# EAGLE schematic simpleshield (EAGLE 8.1.1)
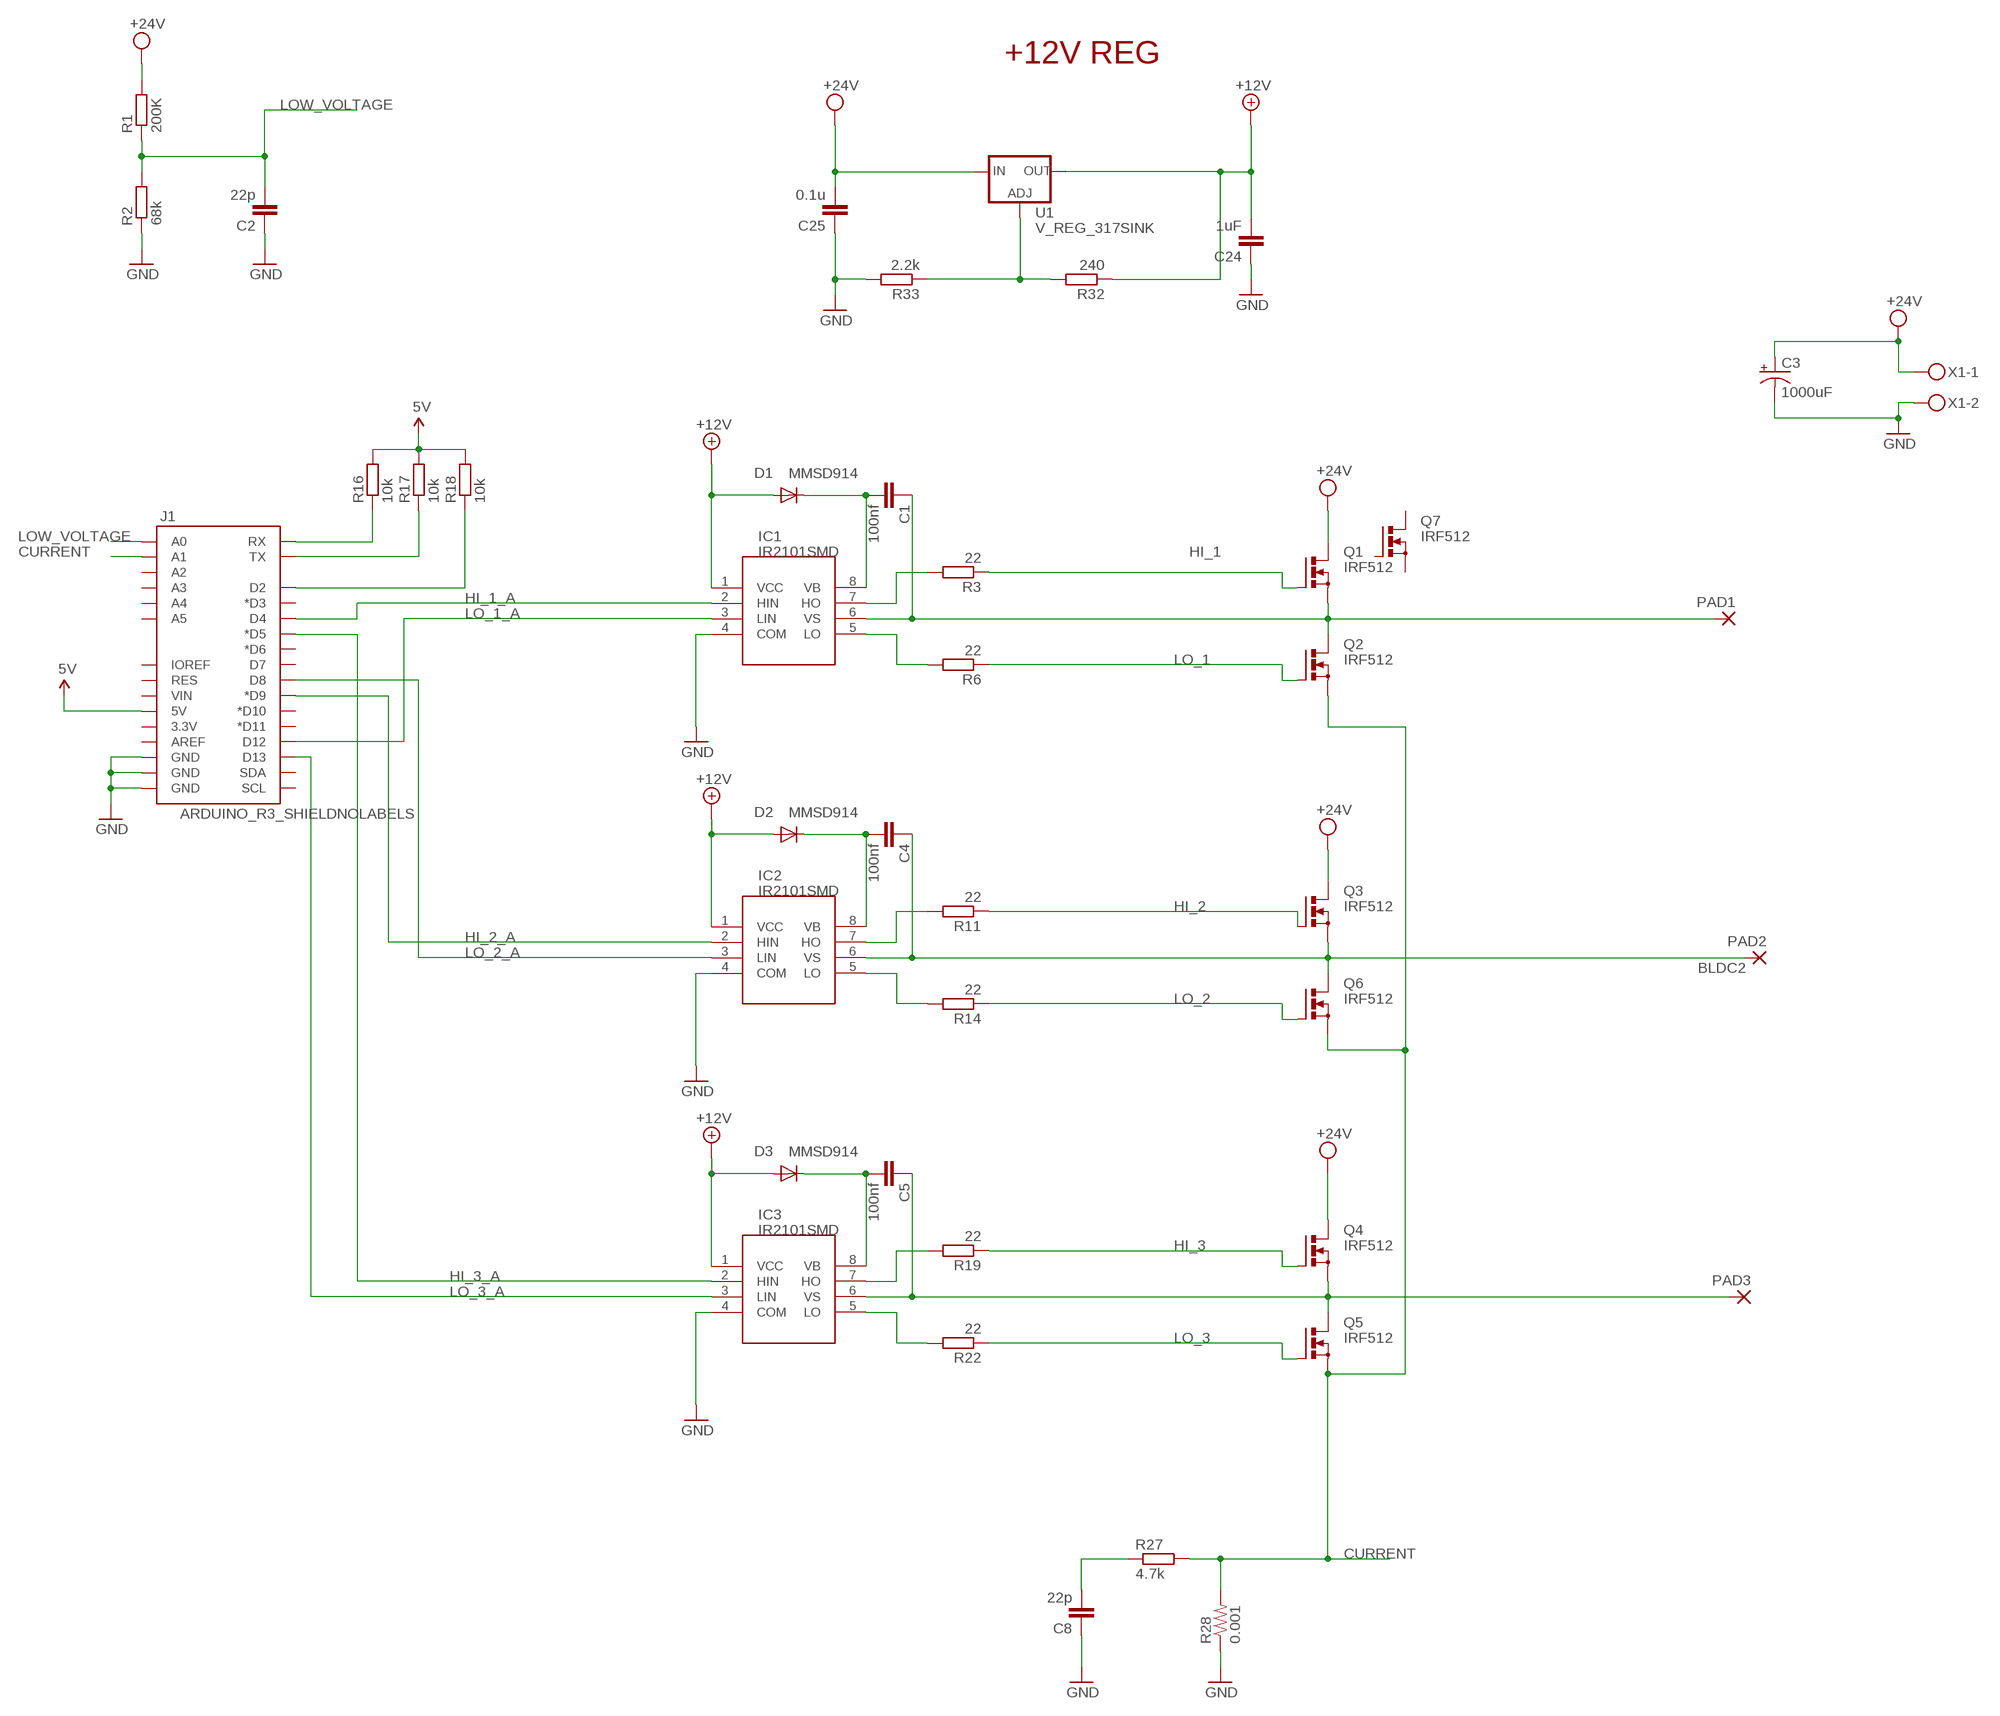
[diagram p0: schematic, sheet 1]

## Parts
C1  100nf  C-EUC1206  [C1206]
C2  22p  C-EUC1206  [C1206]
C3  1000uF  CAP_POLPTH3  [CPOL-RADIAL-1000UF-63V]
C4  100nf  C-EUC1206  [C1206]
C5  100nf  C-EUC1206  [C1206]
C8  22p  C-EUC1206  [C1206]
C24  1uF  C-EUC1206  [C1206]
C25  0.1u  C-EUC1206  [C1206]
D1  MMSD914  DIODE-SOD123  [SOD123]
D2  MMSD914  DIODE-SOD123  [SOD123]
D3  MMSD914  DIODE-SOD123  [SOD123]
IC1  IR2101SMD  [SO08]
IC2  IR2101SMD  [SO08]
IC3  IR2101SMD  [SO08]
J1  ARDUINO_R3_SHIELDNOLABELS  [UNO_R3_SHIELD_NOLABELS]
PAD1  3,81/1,4  [3,81/1,4]
PAD2  3,81/1,4  [3,81/1,4]
PAD3  3,81/1,4  [3,81/1,4]
Q1  IRF512  [TO220BV]
Q2  IRF512  [TO220BV]
Q3  IRF512  [TO220BV]
Q4  IRF512  [TO220BV]
Q5  IRF512  [TO220BV]
Q6  IRF512  [TO220BV]
Q7  IRF512  [TO220BV]
R1  200K  R-EU_R1206  [R1206]
R2  68k  R-EU_R1206  [R1206]
R3  22  R-EU_R1206  [R1206]
R6  22  R-EU_R1206  [R1206]
R11  22  R-EU_R1206  [R1206]
R14  22  R-EU_R1206  [R1206]
R16  10k  R-EU_R1206  [R1206]
R17  10k  R-EU_R1206  [R1206]
R18  10k  R-EU_R1206  [R1206]
R19  22  R-EU_R1206  [R1206]
R22  22  R-EU_R1206  [R1206]
R27  4.7k  R-EU_R1206  [R1206]
R28  0.001  R-US_R2512  [R2512]
R32  240  R-EU_R1206  [R1206]
R33  2.2k  R-EU_R1206  [R1206]
U1  V_REG_317SINK  [TO220-ADJ]
X1  MKDSN1,5/2-5,08  [MKDSN1,5/2-5,08]

## Nets
5V: J1.5V R16.2 R17.2 R18.2
+12V: C24.2 D1.A D2.A D3.A IC1.1(VCC) IC2.1(VCC) IC3.1(VCC) R32.1 U1.OUT
BLDC1: C1.1 IC1.6(VS) PAD1.1(P) Q1.S Q2.D
BLDC2: C4.1 IC2.6(VS) PAD2.1(P) Q3.S Q6.D
BLDC3: C5.1 IC3.6(VS) PAD3.1(P) Q4.S Q5.D
CURRENT: J1.A1 Q2.S Q5.S Q6.S R27.2 R28.2
GND [gnd]: C2.1 C3.2(-) C8.1 C24.1 C25.1 IC1.4(COM) IC2.4(COM) IC3.4(COM) J1.GND@0(GND) J1.GND@1(GND) J1.GND@2(GND) R2.1 R28.1 R33.2 X1.2
HI_1: Q1.G R3.1
HI_1_A: IC1.2(HIN) J1.D4
HI_2: Q3.G R11.1
HI_2_A: IC2.2(HIN) J1.D9(*D9)
HI_3: Q4.G R19.1
HI_3_A: IC3.2(HIN) J1.D5(*D5)
LO_1: Q2.G R6.1
LO_1_A: IC1.3(LIN) J1.D12
LO_2: Q6.G R14.1
LO_2_A: IC2.3(LIN) J1.D8
LO_3: Q5.G R22.1
LO_3_A: IC3.3(LIN) J1.D13
LOW_VOLTAGE: C2.2 J1.A0 R1.1 R2.2
N$1: J1.RX R16.1
N$3: R32.2 R33.1 U1.ADJ
N$4: J1.TX R17.1
N$5: J1.D2 R18.1
N$9: C8.2 R27.1
N$13: IC3.7(HO) R19.2
N$16: IC3.5(LO) R22.2
N$17 [usbvcc]: C5.2 D3.C IC3.8(VB)
N$21: IC2.7(HO) R11.2
N$24: IC2.5(LO) R14.2
N$25 [usbvcc]: C4.2 D2.C IC2.8(VB)
N$29: IC1.7(HO) R3.2
N$32: IC1.5(LO) R6.2
N$33 [usbvcc]: C1.2 D1.C IC1.8(VB)
VCC: C3.1(+) C25.2 Q1.D Q3.D Q4.D R1.2 U1.IN X1.1 ; supply symbol labelled +24V
Unconnected: J1.3.3V J1.A2 J1.A3 J1.A4 J1.A5 J1.AREF J1.D3(*D3) J1.D6(*D6) J1.D7 J1.D10(*D10) J1.D11(*D11) J1.IOREF J1.RES J1.SCL J1.SDA J1.VIN Q7.D Q7.G Q7.S

## Notes on the sheet
- +12V REG

## Library data of the parts
C1 C2 C4 C5 C8 C24 C25 = SmartPrj:C-EU: CAPACITOR, European symbol
C3 = SparkFun-Passives:CAP_POL: Capacitor Polarized These are standard SMD and PTH capacitors. Normally 10uF, 47uF, and 100uF in electrolytic and tantalum varieties. Always verify the external diameter of the through hole cap, it varies with capacity, voltage, and manufacturer. The EIA devices should be standard.
D1-D3 = diode:DIODE-: DIODE
IC1-IC3 = IR:IR2101
J1 = SparkFun-Boards:ARDUINO_R3_SHIELD: Shield form compatible with the Arduino Uno R3.
PAD1-PAD3 = wirepad:3,81/1,4: THROUGH-HOLE PAD
Q1-Q7 = transistor-power:IRF512: N-CHANNEL MOS FET
R1-R3 R6 R11 R14 R16-R19 R22 R27 R32 R33 = SmartPrj:R-EU_: RESISTOR, European symbol
R28 = resistor:R-US_: RESISTOR, American symbol
U1 = SparkFun-PowerIC:V_REG_317: Voltage Regulator Standard LM317 adjustable voltage regulator. AOI (Adjust Output Input). Google 'LM317 Calculator' for easy to use app to get the two resistor values needed. 240/720 for 5V output. 240/390 for 3.3V output. Spark Fun Electronics SKU : COM-00527
X1 = con-phoenix-508:MKDSN1,5/2-5,08: MKDSN 1,5/ 2-5,08 Printklemme Nennstrom: 13,5 A Nennspannung: 250 V Rastermaß: 5,08 mm Polzahl: 2 Anschlussart: Schraubanschluss Montage: Löten Anschlussrichtung Leiter/Platine: 0 ° Artikelnummer: 1729128 Source: http://eshop.phoenixcontact.com .. 1729128.pdf; MPN: MKDSN 1,5/2-5.08; OC_FARNELL: 1792903; OC_NEWARK: 30M2397

## Net classes
0 default: width 0.254 mm, drill 0.61 mm, clearance 0.203 mm
2 gnd: width 0.254 mm, drill 0.61 mm, clearance 0.254 mm
3 usbvcc: width 0.254 mm, drill 0.61 mm, clearance 0.254 mm